# Altium schematic sheet SwitchDaughter.SchDoc
size Letter; SheetNumber: 1; SheetTotal: 1
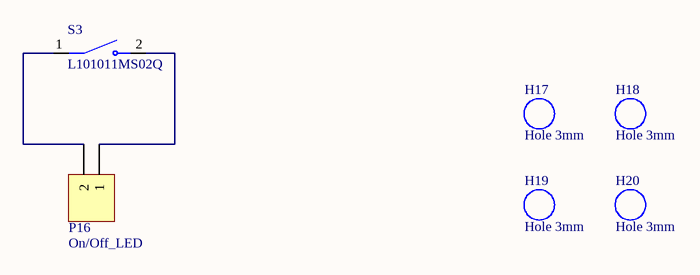
[diagram p0: SwitchDaughter.SchDoc]

## Parts
H17  Hole 3mm  [Hole 3mm]
H18  Hole 3mm  [Hole 3mm]
H19  Hole 3mm  [Hole 3mm]
H20  Hole 3mm  [Hole 3mm]
P16  On/Off_LED  [HDR1X2]
S3  L101011MS02Q  [SW_L101011MS02Q]

## Nets
NetP16_1: P16.1 S3.2
NetP16_2: P16.2 S3.1

## Library data of the parts
P16 = Header 2H: Header, 2-Pin, Right Angle; LatestRevisionDate: 17-Jul-2002; LatestRevisionNote: Re-released for DXP Platform.; Publisher: Altium Limited
S3 = L101011MS02Q: Slide Switch SPST Through Hole; MF: C&K; MP: L101011MS02Q; Value: *; Availability: Unavailable; SnapEDA_Link: https://www.snapeda.com/parts/L101011MS02Q/C%26K/view-part/455586/?ref=snap; Price: None; Package: None